# Altium schematic sheet Not_Used.SchDoc
size A4
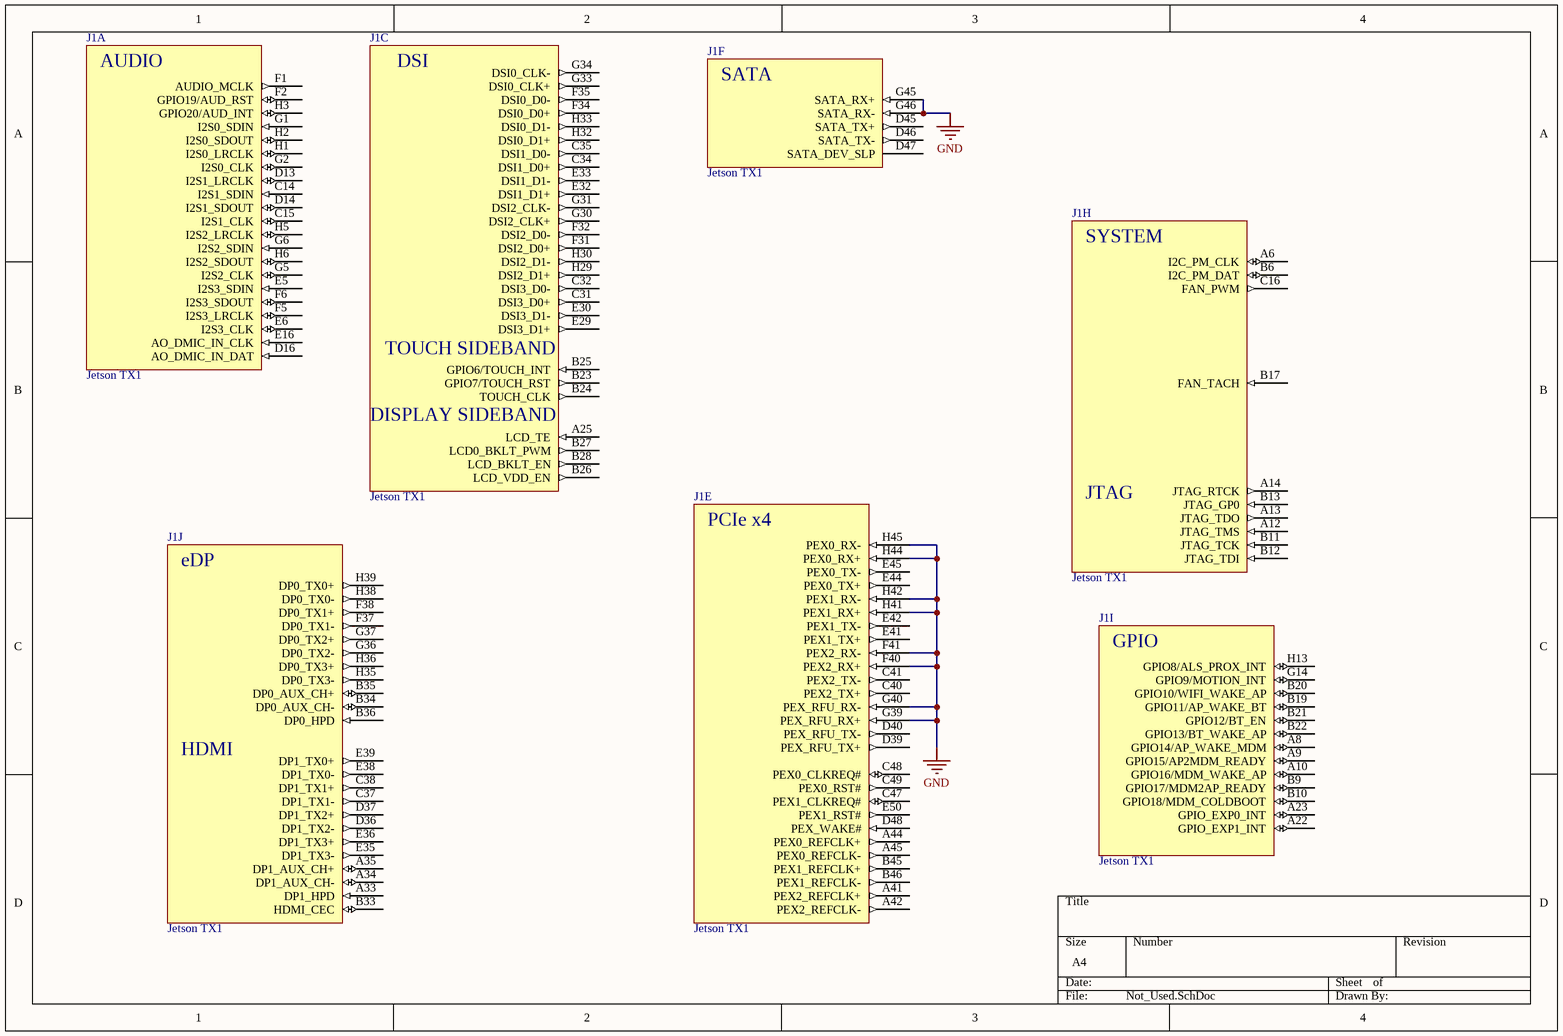
[diagram p0: Not_Used.SchDoc]

## Parts
J1  Jetson TX1  [Nvidia Jetson TX1]  (parts A,C,E,F,H,I,J of 14)

## Nets
GND: J1.F40(PEX2_RX+) J1.F41(PEX2_RX-) J1.G39(PEX_RFU_RX+) J1.G40(PEX_RFU_RX-) J1.G45(SATA_RX+) J1.G46(SATA_RX-) J1.H41(PEX1_RX+) J1.H42(PEX1_RX-) J1.H44(PEX0_RX+) J1.H45(PEX0_RX-)

Not connected (* = marked no-connect by the designer): J1 A6(I2C_PM_CLK) A8(GPIO14/AP_WAKE_MDM) A9(GPIO15/AP2MDM_READY) A10(GPIO16/MDM_WAKE_AP) A12(JTAG_TMS) A13(JTAG_TDO) A14(JTAG_RTCK) A22(GPIO_EXP1_INT) A23(GPIO_EXP0_INT) A25(LCD_TE) A33(DP1_HPD) A34(DP1_AUX_CH-) A35(DP1_AUX_CH+) A41(PEX2_REFCLK+) A42(PEX2_REFCLK-) A44(PEX0_REFCLK+) A45(PEX0_REFCLK-) B6(I2C_PM_DAT) B9(GPIO17/MDM2AP_READY) B10(GPIO18/MDM_COLDBOOT) B11(JTAG_TCK) B12(JTAG_TDI) B13(JTAG_GP0) B17(FAN_TACH) B19(GPIO11/AP_WAKE_BT) B20(GPIO10/WIFI_WAKE_AP) B21(GPIO12/BT_EN) B22(GPIO13/BT_WAKE_AP) B23(GPIO7/TOUCH_RST) B24(TOUCH_CLK) B25(GPIO6/TOUCH_INT) B26(LCD_VDD_EN) B27(LCD0_BKLT_PWM) B28(LCD_BKLT_EN) B33(HDMI_CEC) B34(DP0_AUX_CH-) B35(DP0_AUX_CH+) B36(DP0_HPD) B45(PEX1_REFCLK+) B46(PEX1_REFCLK-) C14(I2S1_SDIN) C15(I2S1_CLK) C16(FAN_PWM) C31(DSI3_D0+) C32(DSI3_D0-) C34(DSI1_D0+) C35(DSI1_D0-) C37(DP1_TX1-) C38(DP1_TX1+) C40(PEX2_TX+) C41(PEX2_TX-) C47(PEX1_CLKREQ#) C48(PEX0_CLKREQ#) C49(PEX0_RST#) D13(I2S1_LRCLK) D14(I2S1_SDOUT) D16(AO_DMIC_IN_DAT) D36(DP1_TX2-) D37(DP1_TX2+) D39(PEX_RFU_TX+) D40(PEX_RFU_TX-) D45(SATA_TX+) D46(SATA_TX-) D47(SATA_DEV_SLP) D48(PEX_WAKE#) E5(I2S3_SDIN) E6(I2S3_CLK) E16(AO_DMIC_IN_CLK) E29(DSI3_D1+) E30(DSI3_D1-) E32(DSI1_D1+) E33(DSI1_D1-) E35(DP1_TX3-) E36(DP1_TX3+) E38(DP1_TX0-) E39(DP1_TX0+) E41(PEX1_TX+) E42(PEX1_TX-) E44(PEX0_TX+) E45(PEX0_TX-) E50(PEX1_RST#) F1(AUDIO_MCLK) F2(GPIO19/AUD_RST) F5(I2S3_LRCLK) F6(I2S3_SDOUT) F31(DSI2_D0+) F32(DSI2_D0-) F34(DSI0_D0+) F35(DSI0_D0-) F37(DP0_TX1-) F38(DP0_TX1+) G1(I2S0_SDIN) G2(I2S0_CLK) G5(I2S2_CLK) G6(I2S2_SDIN) G14(GPIO9/MOTION_INT) G30(DSI2_CLK+) G31(DSI2_CLK-) G33(DSI0_CLK+) G34(DSI0_CLK-) G36(DP0_TX2-) G37(DP0_TX2+) H1(I2S0_LRCLK) H2(I2S0_SDOUT) H3(GPIO20/AUD_INT) H5(I2S2_LRCLK) H6(I2S2_SDOUT) H13(GPIO8/ALS_PROX_INT) H29(DSI2_D1+) H30(DSI2_D1-) H32(DSI0_D1+) H33(DSI0_D1-) H35(DP0_TX3-) H36(DP0_TX3+) H38(DP0_TX0-) H39(DP0_TX0+)

## Notes on the sheet
- (in symbol NVIDIA_Jetson_TX1, part A) AUDIO
- (in symbol NVIDIA_Jetson_TX1, part C) DSI; TOUCH SIDEBAND; DISPLAY SIDEBAND
- (in symbol NVIDIA_Jetson_TX1, part E) PCIe x4
- (in symbol NVIDIA_Jetson_TX1, part F) SATA
- (in symbol NVIDIA_Jetson_TX1, part H) SYSTEM; JTAG
- (in symbol NVIDIA_Jetson_TX1, part I) GPIO
- (in symbol NVIDIA_Jetson_TX1, part J) eDP; HDMI

## Library data of the parts
J1 = NVIDIA_Jetson_TX1: Nvidia computing module